# EasyEDA Pro project ProPrj_EasyFOC_2026-04-13.epro, board EasyFOC Ver1.1
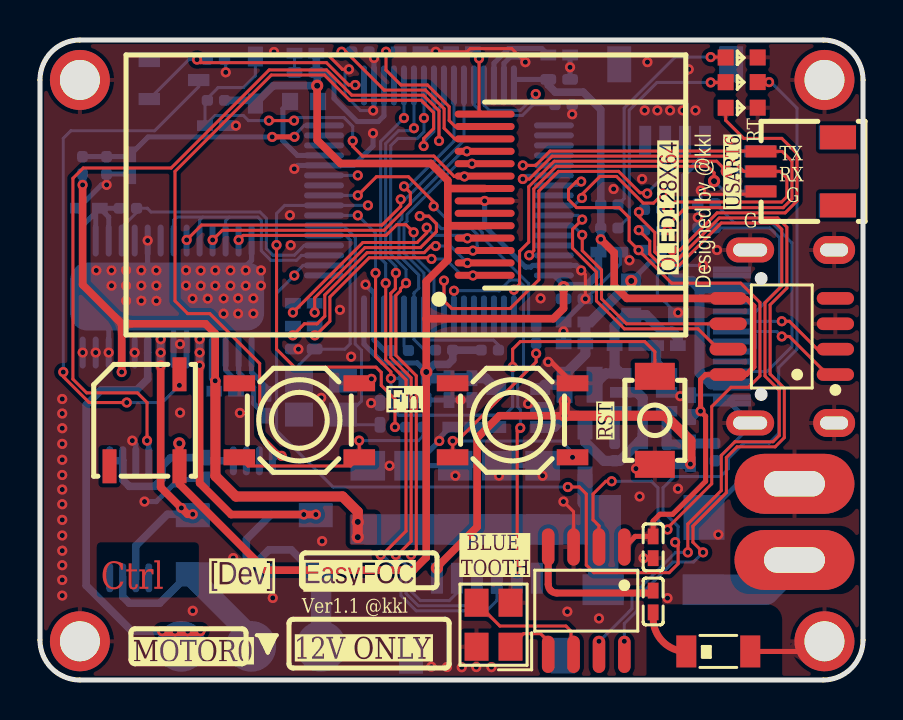
[diagram p4: board, top side]
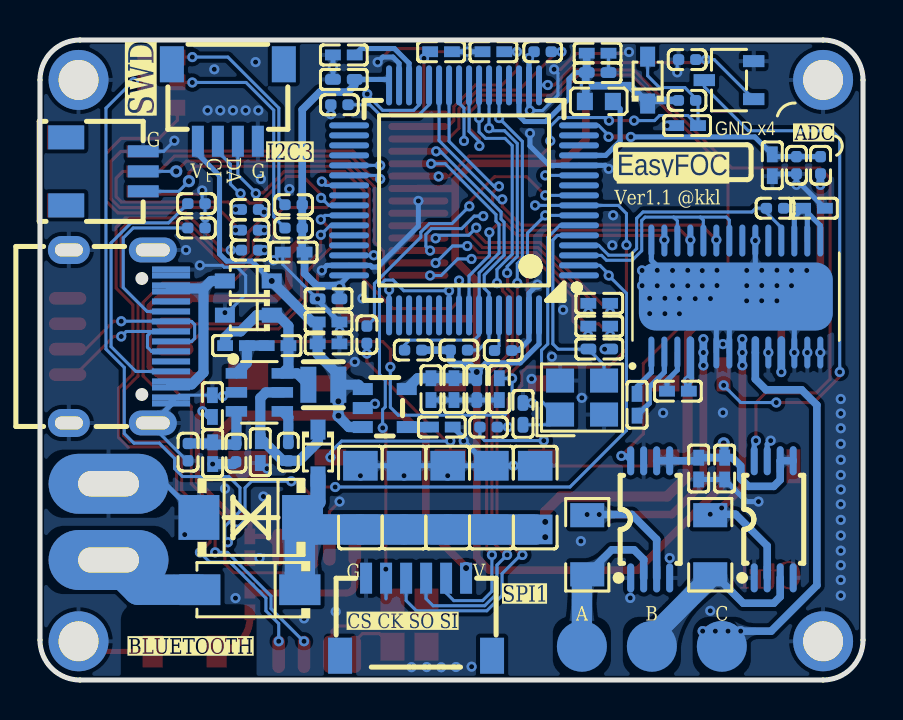
[diagram p5: board, bottom side, seen from below]

Outline 41.17 x 32 mm; copper layers: Top Layer, Bottom Layer. Coordinates in mm from the lower left corner of the outline.
Outline path: 0,30 0,2 arc(0.59,0.59) 2,0 39.17,0 arc(40.58,0.59) 41.17,2 41.17,30 arc(40.58,31.41) 39.17,32 2,32 arc(0.59,31.41) 0,30
Stack: Top Layer 0.035mm / Dielectric1 1.51mm FR4 er 4.5 / Bottom Layer 0.035mm

## Design rules (mm)
template: 自定义配置
spacing copperThickness1oz (default): track to track 0.102, other pairs 0.152 to 0.3
spacing copperThickness2oz: track to track 0.203, other pairs 0.152 to 0.3
track width copperThickness1oz (default): min 0.127, default 0.254, max 2.54
track width copperThickness2oz: min 0.203, default 0.254, max 2.54
differential pair differentialPair (default): width min 0.127, default 0.254, max 2.54; gap min 0.152, default 0.152
via viaSize (default): diameter min 0.508, default 0.508, max 10; hole min 0.254, default 0.254, max 6.299
pour e23671 uses 大师规则

## Placement (name value [footprint] x y rotation side)
BUZZER1  4000Hz  [BUZ-SMD_L5.0-W5.5-P4.60]  5.23 12.98 90 top
C1  100nF  [C0402#2]  19.32 14.54 90 bottom
C2  100nF  [C0402#2]  26.74 19.06 180 bottom
C3  100nF  [C0402#2]  25.97 30.03 180 bottom
C4  100nF  [C0402#2]  13.28 30.37 0 bottom
C5  100nF  [C0402]  13.28 31.34 0 bottom
C6  100nF  [C0402]  18.19 14.54 270 bottom
C7  4.7uF  [C0402]  25.97 31.25 0 bottom
C8  16pF  [C0402#2]  17.01 13.31 270 bottom
C9  16pF  [C0402#2]  13.19 16.55 0 bottom
C10  0.1uF  [C0402]  8.22 10.57 270 bottom
C11  0.1uF  [C0402]  6.92 10.57 270 bottom
C12  10uF  [C0402]  4.54 25.74 270 bottom
C13  10uF  [C0402]  21.61 14.54 90 bottom
C14  100nF  [C0402]  20.46 14.54 90 bottom
C15  10nF  [C0402]  21.07 12.65 0 bottom
C18  100uF  [C1206]  16.4 9.12 270 bottom
C19  100uF  [C1206]  18.59 9.12 270 bottom
C20  100uF  [C1206]  20.78 9.12 270 bottom
C21  100uF  [C1206]  22.96 9.12 270 bottom
C22  100uF  [C1206]  25.14 9.12 270 bottom
C23  100pF  [C0402]  32.53 11.34 270 bottom
C24  100nF  [c0402]  31.37 16.72 0 bottom
C25  100nF  [c0402]  29.29 16.72 180 bottom
C26  100nF  [C0402]  26.74 16.81 0 bottom
C27  10uF  [C0402]  26.74 17.9 0 bottom
C28  10uF  [C0402]  30.15 11.39 270 bottom
C29  10nF  [C0402]  11.3 13.76 270 bottom
C30  0.1u  [C0402]  9.26 14.44 180 bottom
C31  0.47uF  [C0402]  2.45 23.59 0 bottom
C33  1uF  [C0402]  13.2 18.83 0 bottom
C35  4.7uF  [C0402]  28.48 21.39 180 bottom
C36  4.7uF  [C0402]  8.8 27.72 180 bottom
C37  2.2uF  [C0402]  18.49 31.41 180 bottom
C38  4.7uF  [C0402]  21.11 31.41 0 bottom
C39  1uF  [C0402]  13.2 17.69 0 bottom
C42  2.7pF  [C0402]  30.67 3.93 90 top
C43  100nF  [C0402]  30.67 6.63 270 top
C44  100nF  [C0402]  32.54 13.7 270 bottom
CN1  A1002WR-S-3P  [CONN-SMD_A1002WR-S-3P]  37.93 25.43 270 bottom
CN2  A1002WR-S-6P  [CONN-SMD_A1002WR-S-6P]  22.36 3.15 180 bottom
CN6  A1002WR-S-3P  [CONN-SMD_A1002WR-S-3P]  37.99 25.43 90 top
CN7  A1002WR-S-4P  [CONN-SMD_A1002WR-S-4P]  31.77 28.86 0 bottom
D1  SS54  [SMA_L4.4-W2.8-LS5.4-R-RD]  30.67 4.51 0 bottom
D2  SMBJ28CA  [SMB_L4.6-W3.6-LS5.3-BI]  30.63 8.13 180 bottom
D3  B5819WS  [SOD-323_L1.8-W1.3-LS2.5-RD]  30.75 18.24 0 bottom
D4  B5819WS  [SOD-323_L1.8-W1.3-LS2.5-RD]  27.26 11.35 270 bottom
D5  B5819WS  [SOD-323_L1.8-W1.3-LS2.5-RD]  30.75 19.95 0 bottom
D6  B5819WS  [SOD-323_L1.8-W1.3-LS2.5-RD]  10.77 29.99 90 bottom
FB1  600R 100MHz  [L0603]  13.21 28.92 180 bottom
KT6368A1  -  [SOP-8_L4.9-W3.9-P1.27-LS6.0-BL-1]  27.33 3.97 180 top
L1  6.8uH  [IND-SMD_L2.0-W1.6_MHCD201610]  27 14.76 180 bottom
LED1  -  [led_0603]  35.05 31.12 180 top
LED2  -  [led_0603]  35.05 29.89 180 top
LED3  -  [led_0603]  35.05 28.61 180 top
NOREF  -  [Pad_ie98]  37.74 9.81 270 top
NOREF#2  -  [Pad_e98]  39.24 30 0 top
NOREF#3  -  [Pad_e94]  2 30 0 top
NOREF#4  -  [Pad_e96]  2 1.94 0 top
NOREF#5  -  [Pad_e99]  39.24 1.94 0 top
NOREF#6  -  [Pad_ie97]  37.74 6 270 top
P1  电机接插件-3P  [AMASS-MR30-M]  10.56 1.68 180 bottom
Q1  AO3400A  [SOT-23-3_L2.9-W1.6-P1.90-LS2.8-BR]  6.7 29.99 180 bottom
R1  2KΩ  [r0402]  28.48 23.77 0 bottom
R2  5.1KΩ  [r0402]  33.34 22.6 0 bottom
R7  10KΩ  [r0402]  18 16.47 0 bottom
R8  10KΩ  [r0402]  26.19 28.76 0 bottom
R13  5.1KΩ  [r0402]  33.34 23.82 0 bottom
R16  4.7K  [r0402]  8.8 28.98 180 bottom
R17  4.7K  [r0402]  22.5 16.49 0 bottom
R18  10K  [r0402]  4.4 23.59 0 bottom
R19  560K  [r0402]  16.02 31.41 180 bottom
R21  330R  [r0402]  18.73 12.65 180 bottom
R22  330R  [r0402]  24.82 17.26 90 bottom
R23  10K  [r0402]  31.37 11.34 270 bottom
R24  1.8K  [r0402]  33.76 11.39 90 bottom
R25  1M  [r0402]  28.75 11.39 90 bottom
R32  10KΩ  [r0402]  8.8 31.02 180 bottom
R36  100K  [r0402]  2.12 25.74 270 bottom
R37  20K  [r0402]  3.33 25.74 90 bottom
R38  2KΩ  [r0402]  28.48 22.6 0 bottom
R39  4.7K  [r0402]  20.21 16.49 180 bottom
R40  0.01R  [R1206]  13.79 6.76 270 bottom
R41  0.01R  [R1206]  7.64 6.76 90 bottom
R44  100R  [r0402]  30.67 23.53 0 bottom
R45  100R  [r0402]  30.67 22.49 0 bottom
R46  2K  [r0402]  30.66 21.49 0 bottom
SW1  TS-1185-B-A-B-A  [SW-SMD_L4.0-W3.0-LS5.0]  30.76 12.98 270 top
SW3  TS-KG87S  [SW-SMD_4P-L5.2-W5.2-P3.70-LS6.4]  12.97 12.98 180 top
SW4  TS-KG87S  [SW-SMD_4P-L5.2-W5.2-P3.70-LS6.4]  23.64 12.98 180 top
U1  TYPE-C16PIN母座 板上四脚三次molding  [usb-smd_type-c16pin]  37.36 17.18 270 bottom
U2  STM32F401RCT6  [LQFP-64_L10.0-W10.0-P0.50-LS12.0-BL]  19.96 23.98 90 bottom
U4  LP2992IM5X-3.3/NOPB  [SOT-23-5_L2.9-W1.6-P0.95-LS2.8-BR]  23.92 13.6 0 bottom
U5  ME3116AM6G  [SOT-23-6_L2.9-W1.6-P0.95-LS2.8-BL]  30.2 14.38 270 bottom
U8  *  [HTSSOP-28]  6.36 19.17 90 bottom
U9  INA240A2PWR  [TSSOP-8_L4.4-W3.0-P0.65-LS6.4-BL]  10.65 8.03 180 bottom
U10  INA240A2PWR  [TSSOP-8_L4.4-W3.0-P0.65-LS6.4-BL]  4.47 8.04 180 bottom
U12  CH340N  [SOP-8_L4.9-W3.9-P1.27-LS6.0-BL]  37.11 17.18 90 top
U13  SSD1312  [SSD1312-0.96寸]  16.53 24.25 180 top
U14  ANT3216R15753KM1  [ANT-SMD_2P-L3.20-W1.60]  33.93 1.43 0 top
X1  25MHZ 12PF  [CRYSTAL-SMD_4P-L3.2-W2.5-BL]  14.05 14.12 180 bottom
X2  24MHz  [CRYSTAL-SMD_4P-L3.2-W2.5-BL]  22.69 2.77 90 top

## Footprints (pads in the part's own frame, mm; a bottom-side part is the same pattern mirrored in y, then rotated)
AMASS-MR30-M
  rrect 2.5x2.54 smd: 1(-3.5,0) 2(0,0) 3(3.5,0)
ANT-SMD_2P-L3.20-W1.60
  rect 1x1.6 smd: 1(-1.6,0) 2(1.6,0)
BUZ-SMD_L5.0-W5.5-P4.60
  rect 1.7x0.7 smd: 1(-2.3,-1.75) 2(2.3,-1.75) 3(-2.3,1.75)
C0402
  rect 0.79x0.54 smd: 1(-0.545,0) 2(0.545,0)
C0402#2
  rrect 0.79x0.54 smd: 1(-0.545,0) 2(0.545,0)
c0402
  rect 0.79x0.54 smd: 1(-0.545,0) 2(0.545,0)
C1206
  rect 1.485x1.728 smd: 1(-1.593,0) 2(1.593,0)
CONN-SMD_A1002WR-S-3P
  rect 0.6x1.55 smd: 1(-1.003,1.926) 2(-0.001,1.925) 3(0.997,1.926)
  rect 1.2x1.8 smd: 4(1.701,-1.926) 5(-1.701,-1.926)
CONN-SMD_A1002WR-S-4P
  rect 0.6x1.55 smd: 1(-1.5,1.925) 2(-0.5,1.925) 3(0.5,1.925) 4(1.5,1.925)
  rect 1.2x1.8 smd: 5(2.8,-1.925) 6(-2.8,-1.925)
CONN-SMD_A1002WR-S-6P
  rect 0.6x1.55 smd: 1(-2.501,1.938) 2(-1.5,1.938) 3(-0.497,1.936) 4(0.501,1.937) 5(1.502,1.937) 6(2.502,1.937)
  rect 1.2x1.8 smd: 7(3.801,-1.938) 8(-3.801,-1.937)
CRYSTAL-SMD_4P-L3.2-W2.5-BL
  rect 1.4x1.2 smd: 1(-1.1,-0.85) 2(1.1,-0.85) 3(1.1,0.85) 4(-1.1,0.85)
HTSSOP-28
  rrect 1.6x0.3 smd: 1(-2.8,4.225) 2(-2.8,3.575) 3(-2.8,2.925) 4(-2.8,2.275) 5(-2.8,1.625) 6(-2.8,0.975) 7(-2.8,0.325) 8(-2.8,-0.325) 9(-2.8,-0.975) 10(-2.8,-1.625) 11(-2.8,-2.275) 12(-2.8,-2.925) 13(-2.8,-3.575) 14(-2.8,-4.225) 15(2.8,-4.225) 16(2.8,-3.575) 17(2.8,-2.925) 18(2.8,-2.275) 19(2.8,-1.625) 20(2.8,-0.975) 21(2.8,-0.325) 22(2.8,0.325) 23(2.8,0.975) 24(2.8,1.625) 25(2.8,2.275) 26(2.8,2.925) 27(2.8,3.575) 28(2.8,4.225)
  rrect 3.4x9.7 smd: 29(0,0)
IND-SMD_L2.0-W1.6_MHCD201610
  rect 0.8x1.8 smd: 1(-0.75,0) 2(0.75,0)
L0603
  rect 0.8x0.864 smd: 1(-0.7,0) 2(0.7,0)
led_0603
  rect 0.8x0.8 smd: 1(-0.851,-0.01) 2(0.75,-0.005)
LQFP-64_L10.0-W10.0-P0.50-LS12.0-BL
  oval 0.3x2 smd: 1(-3.75,-5.75) 2(-3.25,-5.75) 3(-2.75,-5.75) 4(-2.25,-5.75) 5(-1.75,-5.75) 6(-1.25,-5.75) 7(-0.75,-5.75) 8(-0.25,-5.75) 9(0.25,-5.75) 10(0.75,-5.75) 11(1.25,-5.75) 12(1.75,-5.75) 13(2.25,-5.75) 14(2.75,-5.75) 15(3.25,-5.75) 16(3.75,-5.75) 33(3.75,5.75) 34(3.25,5.75) 35(2.75,5.75) 36(2.25,5.75) 37(1.75,5.75) 38(1.25,5.75) 39(0.75,5.75) 40(0.25,5.75) 41(-0.25,5.75) 42(-0.75,5.75) 43(-1.25,5.75) 44(-1.75,5.75) 45(-2.25,5.75) 46(-2.75,5.75) 47(-3.25,5.75) 48(-3.75,5.75)
  oval 2x0.3 smd: 17(5.75,-3.75) 18(5.75,-3.25) 19(5.75,-2.75) 20(5.75,-2.25) 21(5.75,-1.75) 22(5.75,-1.25) 23(5.75,-0.75) 24(5.75,-0.25) 25(5.75,0.25) 26(5.75,0.75) 27(5.75,1.25) 28(5.75,1.75) 29(5.75,2.25) 30(5.75,2.75) 31(5.75,3.25) 32(5.75,3.75) 49(-5.75,3.75) 50(-5.75,3.25) 51(-5.75,2.75) 52(-5.75,2.25) 53(-5.75,1.75) 54(-5.75,1.25) 55(-5.75,0.75) 56(-5.75,0.25) 57(-5.75,-0.25) 58(-5.75,-0.75) 59(-5.75,-1.25) 60(-5.75,-1.75) 61(-5.75,-2.25) 62(-5.75,-2.75) 63(-5.75,-3.25) 64(-5.75,-3.75)
Pad_e94
  round 3 hole 2: 65(0,0)
Pad_e96
  round 3 hole 2: 65(0,0)
Pad_e98
  round 3 hole 2: 65(0,0)
Pad_e99
  round 3 hole 2: 65(0,0)
Pad_ie97
  rrect 3x6 hole 1.27x3.048: (0,0)
Pad_ie98
  rrect 3x6 hole 1.27x3.048: (0,0)
r0402
  rrect 0.567x0.541 smd: 1(-0.432,0) 2(0.432,0)
R1206
  rect 1.208x1.701 smd: 1(-1.479,0) 2(1.479,0)
SMA_L4.4-W2.8-LS5.4-R-RD
  rect 2.062x1.539 smd: 1(2.503,0) 2(-2.503,0)
SMB_L4.6-W3.6-LS5.3-BI
  rect 2.047x2.241 smd: 1(-2.591,0) 2(2.591,0)
SOD-323_L1.8-W1.3-LS2.5-RD
  rect 1x0.75 smd: 1(-1.173,0) 2(1.173,0)
SOP-8_L4.9-W3.9-P1.27-LS6.0-BL
  oval 0.63x1.865 smd: 1(-1.905,-2.683) 2(-0.635,-2.683) 3(0.635,-2.683) 4(1.905,-2.683) 5(1.905,2.683) 6(0.635,2.683) 7(-0.635,2.683) 8(-1.905,2.683)
SOP-8_L4.9-W3.9-P1.27-LS6.0-BL-1
  oval 0.63x1.865 smd: 1(-1.905,-2.683) 2(-0.635,-2.683) 3(0.635,-2.683) 4(1.905,-2.683) 5(1.905,2.683) 6(0.635,2.683) 7(-0.635,2.683) 8(-1.905,2.683)
SOT-23-3_L2.9-W1.6-P1.90-LS2.8-BR
  rect 1.07x0.6 smd: 1(1.235,-0.95) 2(1.235,0.95) 3(-1.235,0)
SOT-23-5_L2.9-W1.6-P0.95-LS2.8-BR
  rect 1x0.6 smd: 1(1.1,-0.95) 2(1.1,0) 3(1.1,0.95) 4(-1.1,0.95) 5(-1.1,-0.95)
SOT-23-6_L2.9-W1.6-P0.95-LS2.8-BL
  rect 0.532x1.072 smd: 1(-0.95,-1.149) 2(0,-1.149) 3(0.95,-1.149) 4(0.95,1.149) 5(0,1.149) 6(-0.95,1.149)
SSD1312-0.96寸
  oval 3x0.35 smd: 1(-5.715,4.011) 2(-5.715,3.392) 3(-5.715,2.772) 4(-5.715,2.151) 5(-5.715,1.531) 6(-5.715,0.911) 7(-5.715,0.291) 8(-5.715,-0.329) 9(-5.715,-0.949) 10(-5.715,-1.569) 11(-5.715,-2.189) 12(-5.715,-2.809) 13(-5.715,-3.429) 14(-5.715,-4.049)
SW-SMD_4P-L5.2-W5.2-P3.70-LS6.4
  rect 1.58x0.8 smd: 1(-3,1.85) 2(3,1.85) 3(-3,-1.85) 4(3,-1.85)
SW-SMD_L4.0-W3.0-LS5.0
  rect 1.35x2 smd: 1(-2.2,0) 2(2.2,0)
TSSOP-8_L4.4-W3.0-P0.65-LS6.4-BL
  oval 0.353x1.454 smd: 1(-0.975,-2.927) 2(-0.325,-2.927) 3(0.325,-2.927) 4(0.975,-2.927) 5(0.975,2.927) 6(0.325,2.927) 7(-0.325,2.927) 8(-0.975,2.927)
usb-smd_type-c16pin
  oval 1.25x2.4 hole 0.65x1.7: 17(-4.325,1.835) 18(4.325,1.835)
  oval 1.4x2.1 hole 0.65x1.4: 19(-4.325,-2.365) 20(4.325,-2.365)
  rect 0.3x1.905 smd: A1(-3.35,2.746) A4(-2.55,2.746) A5(-1.25,2.746) A6(-0.25,2.746) A7(0.25,2.746) A8(1.25,2.746) A9(2.55,2.746) A12(3.35,2.746) B1(3.05,2.746) B4(2.25,2.746) B5(1.75,2.746) B6(0.75,2.746) B7(-0.75,2.746) B8(-1.75,2.746) B9(-2.25,2.746) B12(-3.05,2.746)

## Nets
As in the schematic, except:
GND: C1.1 C2.1 C3.1 C4.1 C5.1 C6.2 C7.2 C8.1 C9.1 C10.2 C11.2 C12.2 C13.1 C14.1 C15.1 C18.1 C19.1 C20.1 C21.1 C22.1 C26.1 C27.1 C28.2 C31.1 C35.1 C36.1 C37.1 C38.1 C43.2 C44.1 CN1.1 CN2.1 CN6.1 CN7.1 D2.1 D3.2 KT6368A1.3 LED1.1 LED3.1 NOREF. NOREF#2.65 NOREF#3.65 NOREF#4.65 NOREF#5.65 Q1.2 R2.1 R7.1 R8.2 R13.1 R19.1 R24.1 R32.1 R37.1 SW1.2 SW3.3 SW3.4 SW4.3 SW4.4 U1.17 U1.18 U1.19 U1.20 U1.A1 U1.A12 U1.B1 U1.B12 U2.12 U2.18 U2.31 U2.47 U2.63 U4.2 U5.2 U8.6 U8.7 U8.10 U8.12 U8.13 U8.14 U8.20 U8.28 U8.29 U9.1 U9.4 U9.7 U10.1 U10.4 U10.7 U12.3 U13.7 U14.2 X1.2 X1.4 X2.2 X2.4
VCC_IN: D1.1 NOREF#6.

Pads without a net: BUZZER1 3; CN1 4 5; CN2 7 8; CN6 4 5; CN7 5 6; U1 A8 B8; U8 19 21; U12 4; U13 6

## Via types
v1: diameter 0.508, hole 0.254, Top Layer to Bottom Layer, 242 vias
v2: diameter 0.61, hole 0.305, Top Layer to Bottom Layer, 12 vias

## Routing (per net, layer and track width the routed paths; a pad name or vN(x,y) marks a point on that pad's centre or on a via; arc(x,y) is an arc through that point)
3.3V: length 138.8
  Top Layer w0.254: U12.5 35.33,19.08 35.71,18.7 35.71,15.65 35.33,15.27 U12.8 33.3,15.27 33.04,15.02 v1(33.04,13.44) 33.3,13.19 33.3,9.94 31.64,8.29 31.01,8.29 30.67,7.95 C43.1 29.78,7.18 29.25,6.65 KT6368A1.1
  Top Layer w0.381: 20.4,24.57 U13.8 ; 20.4,24.57 20.4,22.71 ; 20.4,24.57 20.4,24.98 19.55,25.83 15.03,25.83 13.86,27 v2(13.86,29.72) ; 20.4,22.71 U13.5 ; 20.4,22.71 20.4,21.01 19.32,19.93 19.32,18.06 ; v2(26.19,19.64) 26.19,18.58 25.68,18.06 19.32,18.06 ; U12.5 29.36,19.08 28.72,19.72 28.72,21.36 v1(28.05,22.04) ; 19.32,18.06 v2(19.32,15.4) 19.32,15.4 19.32,6.13 18.68,5.49 11.28,5.49 6.98,9.79 BUZZER1.1 6.98,11.82 v2(6.97,11.83)
  Bottom Layer w0.254: C4.2 14.39,30.37 14.71,30.05 14.71,29.08 15.87,27.92 16.92,27.92 17.21,28.21 U2.19 ; C3.2 23.71,30.03 U2.32 ; v1(33.04,13.44) 32.75,13.15 C44.2 ; U2.64 16.21,16.79 17.15,15.86 18.87,15.86 v2(19.32,15.4) C1.2 ; U2.48 26.19,19.75 v2(26.19,19.64)
  Bottom Layer w0.381: U10.5 U10.6 4.14,10.01 4.47,9.68 5.74,9.68 6.12,10.06 6.12,10.7 6.54,11.12 C11.1 ; v2(13.86,29.72) 13.86,28.97 FB1.1 ; v2(13.86,29.72) 13.86,30.33 C4.2 C5.2 ; v2(13.86,29.72) 11.67,29.72 D6.1 10.62,28.98 9.24,28.98 ; C11.1 C10.1 8.38,10.96 U9.5 10.32,10.96 ; C11.1 6.92,11.79 v2(6.97,11.83) ; C3.2 25.43,29.75 25.77,29.4 27.17,29.4 28.05,28.52 R1.1 R38.1 v1(28.05,22.04) 28.05,21.51 C35.2 27.94,20.32 27.33,19.72 26.27,19.72 v2(26.19,19.64) C2.2 ; 22.07,16.49 R39.1 20.65,16.01 20.42,15.78 19.71,15.78 19.32,15.39
  Bottom Layer w0.508: C1.2 C14.2 C13.2 22.28,15.09 U4.5
5V: length 42.4
  Top Layer w0.381: v2(26.24,13.21) 22.98,13.21 21.87,12.1 21.87,7.65 19.86,5.64 v2(19.86,5.6)
  Top Layer w0.508: v1(32.53,10.8) 32.53,11.97 31.29,13.21 v2(26.24,13.21) 26.24,13.22 v2(26.24,13.93)
  Bottom Layer w0.254: CN7.4 33.27,26.3 32.19,25.21 32.19,21.3 31.83,20.94 30.57,20.94 v2(29.58,19.95)
  Bottom Layer w0.508: v2(29.58,19.95) 29.58,19.93 27.54,17.9 C27.2 C26.2 27.28,16.3 26.24,15.26 L1.2 ; L1.2 25.24,14.76 U4.1 ; L1.2 v2(26.24,13.93) 26.24,13.17 25.72,12.65 U4.3 ; 31.37,10.91 31.48,10.8 v1(32.53,10.8)
GND: length 122.7
  Top Layer w0.152: v1(27.28,19.06) 27.28,20.27 v1(27.07,20.48) ; v1(24.28,30.89) 23.6,31.57 21.51,31.57 21.36,31.41 v1(19.8,31.41) ; v1(33.06,24.48) 33.25,24.29 35.93,24.29 CN6.1 ; KT6368A1.3 26.69,8.41 v1(26.18,8.92) ; v1(11.71,31.4) 11.78,31.33 14.33,31.33 15.12,30.53 v1(15.45,30.53)
  Top Layer w0.254: U14.2 38.73,1.43 NOREF#5.65 ; v1(25.42,15.91) 25.57,15.91 SW4.3
  Bottom Layer w0.152: v1(16.67,28.47) 16.03,28.47 15.26,29.24 15.26,30.34 v1(15.45,30.53) ; 33.76,10.96 33.81,10.96 35.52,12.67 U1.18 ; v1(27.28,19.06) 27.3,19.06 29.03,20.78 29.03,21.39 29.08,21.39 v1(29.49,20.99) ; v1(34.45,26.97) 34.98,26.43 CN1.1 ; 16.46,31.33 16.46,31.35 ; U5.2 31.84,14.38 v1(32.03,14.19) 32.49,14.19 C44.1 34.2,14.24 U1.A12 ; v1(33.17,20.73) 32.05,20.73 31.96,20.64 31.3,20.64 30.88,20.22 30.88,19.28 D3.2 ; v1(9.29,30.38) 9.29,30.96 R32.1 ; v1(33.06,24.48) 33.06,23.97 R13.1 32.91,23.13 v1(32.9,23.13) 32.91,23.12 R2.1 ; 12.73,30.37 12.73,31.34
  Bottom Layer w0.254: U1.B1 U1.A12 34.61,13.76 U1.18 ; v1(3.44,16.37) 3.44,17.99 4.61,19.17 U8.29 ; 19.03,31.41 v1(19.8,31.41) C38.1 ; U2.31 23.21,30.84 23.52,31.15 24.02,31.15 v1(24.28,30.89) ; 26.62,28.29 R8.2 ; 25.14,10.71 18.74,10.71 ; v1(16.57,13.85) 17,13.85 C8.1 ; U8.7 6.69,18.85 ; 6.69,18.85 U8.29 ; 6.69,18.85 7.34,18.2 U8.6 ; R7.1 17.23,16.47 16.71,17 U2.63 16.71,19.35 v1(16.28,19.77) ; U8.29 8.77,19.17 10.59,20.99 U8.28 ; U8.29 5.39,20.15 v1(5.39,21.97) ; 18.74,10.71 v1(17.48,10.71) 16.4,10.71 ; 18.74,10.71 v1(19.97,11.95) 19.97,12.1 C15.1 ; v1(12.72,25.56) 12.89,25.73 U2.12 15.69,25.73 16.66,26.7 v1(16.66,27.34) ; C26.1 26.18,16.81 v1(26.18,17.43) 26.19,17.44 C27.1 27.28,18.99 v1(27.28,19.06) ; 18.2,14 C1.1 C14.1 21.03,14 v1(21.04,14) 21.04,14 C13.1 ; 3.33,25.3 4.43,25.3 C12.2 ; 3.33,25.3 v1(3.33,24.76) 3.08,24.76 C31.1 ; 3.33,25.3 R37.1 ; v1(5.23,8.92) 5.82,8.92 C11.2 C10.2 ; R19.1 16.46,31.35 v1(16.71,31.1) U2.18 16.71,28.52 v1(16.67,28.47) ; D2.1 34.9,9.81 37.74,9.81 ; v1(4.62,11.97) 4.79,11.8 U10.7 ; C3.1 v1(26.52,30.64) 26.52,31.25 ; v1(22.24,23.95) 22.24,22.7 24.29,20.65 24.56,20.65 24.64,20.73 U2.47 26.82,20.73 v1(27.07,20.48)
  vias: v1(1.11,14.05) v1(1.11,13.32) v1(1.11,12.59) v1(1.11,11.81) v1(1.11,11.01) v1(1.11,10.25) v1(1.11,9.52) v1(1.11,8.79) v1(1.11,8.01) v1(1.11,7.23) v1(1.11,6.47) v1(1.11,5.74) v1(1.11,5) v1(1.11,4.22) v1(2.14,16.37) v1(2.82,20.48) v1(2.79,16.37) v1(3.58,20.48) v1(3.58,19.72) v1(4.31,20.49) v1(4.31,19.72) v1(4.31,18.96) v1(4.74,16.37) v1(5.07,20.48) v1(5.07,19.72) v1(5.07,18.96) v1(5.82,20.48) v1(5.82,19.72) v1(5.82,18.96) v1(7.01,16.8) v1(7.01,13.37) v1(7.31,20.49) v1(7.31,19.72) v1(7.63,19.07) v1(7.64,3.46) v1(8.04,20.47) v1(8.04,19.71) v1(8.39,19.07) v1(8.77,20.48) v1(8.77,19.71) v1(9.18,19.08) v1(9.18,18.31) v1(9.53,20.48) v1(9.53,19.72) v1(9.67,6.1) v1(9.8,27.72) v1(9.91,19.09) v1(9.91,18.32) v1(10,13.35) v1(10.29,20.48) v1(10.29,19.71) v1(10.67,19.08) v1(10.67,18.32) v1(11.05,20.48) v1(11.05,19.72) v1(11.64,4.1) v1(12.5,23.24) v1(12.54,21.74) v1(12.93,16.54) v1(14.07,14.11) v1(14.11,6.94) v1(15,18.51) v1(15.56,16.17) v1(16.58,15.06) v1(19.58,0.67) v1(20.36,0.65) v1(20.78,10.21) v1(21.1,0.64) v1(21.82,0.65) v1(22.58,0.64) v1(22.96,10.21) v1(24.42,13.81) v1(25.04,19.08) v1(25.14,10.21) v1(26.38,3.42) v1(26.62,28.29) v1(27.96,3.08) v1(28.69,24.55) v1(29.81,10.57) v1(29.99,9.17) v1(30.12,25.05) v1(30.19,6.09) v1(30.25,28.48) v1(30.39,30.89) v1(30.88,28.48) v1(31.39,4.09) v1(31.52,28.48) v1(31.92,18.37) v1(31.91,9.57) v1(32.15,28.48) v1(32.45,30.53) v1(32.79,28.48) v1(33.86,21.5) v1(33.93,7.27)
V3P3: length 6.1
  Bottom Layer w0.254: C31.2 3.97,23.59 ; C31.2 2.79,23.38 ; C31.2 3.44,23.15 U8.17 ; 2.79,23.38 U8.16 ; 2.79,23.38 2.14,22.73 U8.15
VBUS: length 8.9
  Bottom Layer w0.508: 34.62,19.57 32.99,19.57 ; 32.99,19.57 32.61,19.95 D5.2 ; 32.99,19.57 32.99,15.37 33.58,14.78 34.61,14.78
VCC: length 54
  Top Layer w0.381: 4.09,17.81 2.13,19.76 v1(2.13,24.75) ; 4.09,17.81 8.28,17.81 8.76,17.32 v1(8.76,14.96) ; 4.09,17.81 v1(4.09,15.4)
  Top Layer w0.508: v1(8.76,14.96) 8.77,14.95 8.77,10.2 9.8,9.17 15.14,9.17 15.9,8.41 v2(15.9,7.91) v2(15.9,7.14)
  Bottom Layer w0.381: v1(2.13,24.75) 2.13,25.3 R36.2 ; v1(4.09,15.4) 4.09,17 ; 8.64,16.98 8.64,15.09 v1(8.76,14.96) 8.76,14.49 C30.2
  Bottom Layer w0.762: D4.2 27.26,8.9 D2.2
  Bottom Layer w1.524: 16.4,7.52 18.58,7.52 C19.2 C20.2 C21.2 C22.2 27.44,7.53 D2.2 28.17,7.99 D1.2
VCC_IN: length 5.2
  Bottom Layer w1.524: 37.74,6 36.26,4.51 D1.1
ADC1: length 12.8
  Top Layer w0.254: v1(12.73,27.16) 11.62,27.16 v1(11.62,27.15)
  Bottom Layer w0.152: U2.16 13.23,27.73 12.73,27.23 v1(12.73,27.16)
  Bottom Layer w0.254: v1(11.62,27.15) 5.41,27.15 C12.1 4.43,26.17 R37.2 R36.1
BEEPER: length 12.6
  Top Layer w0.152: v1(15.77,29.75) 15.45,29.75 14.33,30.87 8.01,30.87 v1(7.86,31.02)
  Bottom Layer w0.152: v1(15.77,29.75) 16.19,29.75 U2.17 ; Q1.1 7.45,31.02 v1(7.86,31.02) R32.2
BOOT0: length 1.8
  Bottom Layer w0.152: R7.2 18.21,16.7 U2.60
BT_RX: length 24.3
  Top Layer w0.152: CN6.3 37.12,26.43 37.61,25.94 37.61,24.06 37.17,23.62 32.29,23.62 31.38,22.71 v1(31.38,22.49) ; 36,26.45 25.51,26.45 24.8,25.73 v1(24.15,25.73)
  Bottom Layer w0.152: v1(24.15,25.73) U2.37
BT_STA: length 37.6
  Top Layer w0.152: v1(28.6,9.94) 28.31,9.94 27.67,9.3 27.67,8.01 27.96,7.71 27.96,6.65 ; v1(27.07,24.92) 26.83,24.92 26.44,24.53 26.44,24.03 26.84,23.62 28.97,23.62 29.47,23.12 29.47,21.97 v1(29.94,21.49) 31.59,19.84 35.05,19.84 36.01,18.88 36.01,15.21 35.44,14.64 34.57,14.64 33.6,13.67 33.6,9.81 31.39,7.6 v1(31.39,7.52)
  Bottom Layer w0.152: v1(27.07,24.92) 26.88,24.73 U2.39 ; v1(28.6,9.94) 30.58,9.94 30.91,9.61 30.91,8 v1(31.39,7.52)
BT_TX: length 22.9
  Top Layer w0.152: v1(31.38,23.53) 31.76,23.9 37.1,23.9 37.36,24.16 37.36,25.09 37.02,25.43 CN6.2 35.2,25.43 34.44,26.19 25.62,26.19 24.48,25.05 v1(24.15,25.05)
  Bottom Layer w0.152: v1(24.15,25.05) 24.33,25.23 U2.38
D+: length 8.2
  Top Layer w0.152: v1(37.11,17.18) 37.49,17.18 39.39,15.27 U12.1
  Bottom Layer w0.152: 35.59,17.43 35.8,17.22 35.8,16.64 35.58,16.43 U1.B6 ; 35.59,17.43 36.86,17.43 v1(37.11,17.18) ; 35.59,17.43 U1.A6
D-: length 8.9
  Top Layer w0.152: v1(37.11,17.94) 37.49,17.94 38.88,16.54 U12.2
  Bottom Layer w0.152: U1.A7 33.58,16.93 33.43,17.08 33.43,17.77 33.58,17.93 U1.B7 34.63,17.94 v1(37.11,17.94)
DRV_EN: length 13
  Bottom Layer w0.152: 8.14,23.14 7.99,22.99 U8.24 ; 8.14,23.14 9.47,23.14 ; 8.14,23.14 6.84,23.14 6.69,22.99 U8.22 ; 9.47,23.14 10.9,23.14 11.07,22.98 11.07,21.46 11.55,20.99 12.83,20.99 13.08,21.23 U2.3 ; 9.47,23.14 9.29,22.96 U8.26
DRV_FAULT: length 13.4
  Bottom Layer w0.152: U2.4 13.22,21.73 12.73,21.24 11.65,21.24 11.33,21.57 11.33,23.08 11.01,23.4 5.56,23.4 5.37,23.59 R18.2 4.83,23.37 4.09,22.62 U8.18
I2C3_SCL: length 10
  Top Layer w0.152: 31.14,24.29 30.69,23.84 30.17,23.84 28.84,25.18 28.01,25.18 27.11,24.28 v1(27.11,24.1)
  Bottom Layer w0.152: U2.41 26.72,23.73 26.94,23.94 26.96,23.94 27.12,24.1 ; 31.14,24.29 31.64,24.8 31.64,25.79 32.27,26.42 CN7.3
  vias: v1(31.14,24.33)
I2C3_SDA: length 21.9
  Top Layer w0.152: v1(20.21,19.97) 20.21,18.96 20.6,18.57 23.52,18.57 24.96,20.01 24.96,24.45 25.93,25.43 28.95,25.43 30.02,24.36 30.34,24.36 v1(30.37,24.33)
  Bottom Layer w0.152: v1(20.21,19.97) U2.56 ; 30.37,24.36 31.27,25.26 CN7.2
KEY0: length 20.8
  Top Layer w0.152: v1(11.83,21.75) 11.83,16.54 12.73,15.64 16.81,15.64 17.07,15.38 17.07,14.73 17.76,14.05 v1(17.76,12.65)
  Bottom Layer w0.152: v1(16.4,23.73) U2.8 12.24,23.73 11.83,23.32 v1(11.83,21.75) ; R21.2 18.3,12.65 v1(17.76,12.65)
KEY1: length 15.4
  Top Layer w0.152: v1(19.69,23.69) 19.69,23.9 18.43,25.16 16.83,25.16 v1(15.9,24.23)
  Bottom Layer w0.152: v1(19.69,23.69) 20.56,22.82 21.69,22.82 22.12,22.39 22.12,22.14 24.44,19.82 24.44,18.07 R22.2 ; U2.9 v1(15.9,24.23)
MOTOR_A: length 8.2
  Bottom Layer w0.381: U9.2 10.97,6.03 11.45,6.51 12.57,6.51 R40.2
  Bottom Layer w1.016: P1.1 14.06,5.01 R40.2
MOTOR_A_CS: length 19
  Top Layer w0.381: v1(13.8,8.27) v1(13.2,8.27) 9.56,8.27 7.99,9.85 v1(7.99,15.73)
  Bottom Layer w0.381: R40.1 13.8,8.25 v1(13.8,8.27) ; U8.5 7.99,15.73 ; 10.32,5.11 10.32,7.03 11.57,8.27 v1(13.2,8.27) ; v1(7.99,17.04) 7.99,16.37
  vias: v1(7.99,16.37)
MOTOR_B: length 10.1
  Bottom Layer w0.381: 7.43,5.28 5.99,3.84 4.47,3.84 4.14,4.17 U10.3 ; 7.47,5.28 R41.1
  Bottom Layer w1.016: P1.2 10.56,2.19 7.47,5.28 7.43,5.28
MOTOR_B_CS: length 14.7
  Top Layer w0.381: v1(6.04,15.73) 6.04,9.64 v1(7.07,8.6) 7.39,8.29 v1(7.64,8.29)
  Bottom Layer w0.381: v1(6.04,17.04) 6.04,16.38 v1(6.04,16.37) 6.04,15.73 ; U10.2 4.79,6.71 6.37,8.29 v1(7.64,8.29) R41.2
MOTOR_C: length 21.2
  Top Layer w0.508: 8.02,2.44 v1(7.39,2.44) v1(6.75,2.44) v1(6.12,2.44)
  Bottom Layer w0.381: v1(6.12,2.44) 4.6,2.44 2.31,4.73 2.31,13.75 3.07,14.51 4.85,14.51 5.39,15.05 U8.9 5.39,17
  vias: v1(8.02,2.44)
NRST: length 30.7
  Top Layer w0.152: v1(23.64,15.65) 23.64,16.54 24.02,16.92 30.25,16.92 30.76,16.41 SW1.1 ; v1(17.55,15.08) 17.55,15.4 16.79,16.17 v1(16.79,20.35) ; v1(15.9,23.23) 15.9,23.14
  Bottom Layer w0.152: C6.1 18.18,15.08 v1(17.55,15.08) 17.55,13.61 17.93,13.24 23.24,13.24 23.64,13.64 v1(23.64,15.65) ; U2.7 v1(15.9,23.23) 16.79,22.34 v1(16.79,20.35)
OLED_SCL: length 15
  Bottom Layer w0.152: 22.93,16.49 22.93,16.74 22.68,16.99 19.45,16.99 19.21,17.24 U2.58 19.2,18.24 19.2,20.35 18.21,21.35 18.21,22.79 18.36,22.94 18.36,23.27 20.9,25.81 v1(21.61,25.81)
OLED_SDA: length 12.7
  Bottom Layer w0.152: R39.2 19.24,16.49 18.71,17.03 U2.59 18.71,19.35 18.95,19.59 18.95,20.25 17.95,21.24 17.95,22.89 18.11,23.04 18.11,23.4 21.14,26.43 v1(21.35,26.43)
OSC_IN: length 10.4
  Bottom Layer w0.152: U2.5 15.28,22.23 15.52,22 15.52,16.81 15.25,16.54 13.75,16.54 ; 13.75,16.54 C9.2 ; 13.75,16.54 12.95,15.75 X1.3
OSC_OUT: length 13.4
  Bottom Layer w0.152: U2.6 15.17,22.73 15.77,22.13 15.77,16.8 16.08,16.49 16.08,13.95 15.41,13.27 15.15,13.27 15.66,12.76 C8.2
PA5: length 34
  Top Layer w0.152: v1(17.04,6.25) 17.12,6.25 18.31,7.44 18.31,15.01 17.29,16.02 v1(17.29,19.84)
  Bottom Layer w0.152: v1(17.29,19.84) 17.29,20.82 17.04,21.08 17.04,26.93 v1(18.21,28.1) U2.21 ; v1(17.04,6.25) 17.12,6.25 18.06,5.32 18.06,4.22 18.82,3.46 22.34,3.46 22.85,3.97 CN2.3
PA6: length 32.6
  Top Layer w0.152: v1(17.8,6.25) 17.88,6.25 18.56,6.94 18.56,15.11 17.55,16.13 17.55,19.33 17.78,19.56 17.78,20.33 v1(17.8,20.35)
  Bottom Layer w0.152: v1(17.8,6.25) 18.31,5.75 18.31,4.33 18.92,3.71 21.51,3.71 21.86,4.06 CN2.4 ; v1(17.8,20.35) 17.8,20.67 17.29,21.18 17.29,26.83 17.93,27.46 18.58,27.46 v1(18.71,27.59) U2.22
PA7: length 31
  Top Layer w0.152: v1(18.31,19.84) 18.03,19.56 18.03,19.46 17.8,19.23 17.8,16.23 18.82,15.21 18.82,6.51 v1(18.56,6.25)
  Bottom Layer w0.152: v1(18.56,6.25) 18.56,4.43 19.03,3.97 20.47,3.97 20.86,4.35 CN2.5 ; U2.23 v1(19.21,28.1) 19.21,27.41 18.88,27.08 17.91,27.08 17.55,26.72 17.55,21.29 18.31,20.53 v1(18.31,19.84)
PA9: length 13.9
  Top Layer w0.152: U12.7 33.93,16.54 32.92,17.56 29.23,17.56 27.83,18.95 27.83,20.4 26.64,21.59 26.64,22.54 v1(27.12,23.02)
  Bottom Layer w0.152: U2.42 26.92,23.23 v1(27.12,23.02)
PA10: length 12.1
  Top Layer w0.152: v1(27.12,22.26) 27.13,22.25 27.13,21.47 28.09,20.5 28.09,19.06 29.34,17.81 U12.6
  Bottom Layer w0.152: v1(27.12,22.26) 26.65,22.73 U2.43
PA13: length 17.2
  Top Layer w0.152: v1(24.47,21.24) 24.7,21.46 24.7,24.56 25.83,25.69 33.39,25.69 33.72,25.36 v2(33.72,24.94)
  Bottom Layer w0.152: v2(33.72,24.94) 34.23,24.43 36,24.43 ; U2.46 25.7,21.24 v1(24.47,21.24)
PA14: length 19
  Top Layer w0.152: v2(34.36,25.43) 33.85,25.94 25.72,25.94 24.45,24.66 24.45,21.89 23.99,21.44 23.99,19.8 v1(23.7,19.51)
  Bottom Layer w0.152: v1(23.7,19.51) 23.71,19.51 U2.49 ; v2(34.36,25.43) CN1.2
PB0: length 17.9
  Top Layer w0.152: v1(8.64,22) 9.12,22.48 17.21,22.48 18.53,23.8 18.53,24.36 v1(18.21,24.68)
  Bottom Layer w0.152: v1(8.64,22) U8.25 ; U2.26 20.71,26.94 18.45,24.68 v1(18.21,24.68)
PB1: length 18.9
  Top Layer w0.152: v1(18.04,24.03) 18.04,23.68 17.11,22.75 8.08,22.75 v1(7.34,22)
  Bottom Layer w0.152: U2.27 21.21,26.97 18.27,24.03 v1(18.04,24.03) ; v1(7.34,22) U8.23
PB2: length 5.5
  Bottom Layer w0.152: R8.1 24.67,28.76 24.13,28.23 22.24,28.23 21.71,28.76 U2.28
PB3: length 20.5
  Top Layer w0.152: v1(24.02,12.6) 23.87,12.45 v1(23.87,5.54)
  Bottom Layer w0.152: 23.86,4.06 23.86,5.09 CN2.2 ; U2.55 v1(20.71,19.46) 22.97,19.46 23.51,20 23.9,20 24.19,19.71 24.19,15.28 23.9,14.99 23.9,13.65 24.03,13.52 24.03,12.61 v1(24.02,12.6)
PB5: length 13.8
  Top Layer w0.152: v1(9.94,22) 10.17,22.23 17.31,22.23 17.84,22.76 18.31,22.76 v1(18.69,22.38)
  Bottom Layer w0.152: U2.57 19.71,20.21 18.69,21.22 v1(18.69,22.38) ; v1(9.94,22) U8.27
PB10: length 4
  Bottom Layer w0.152: v1(24.8,29.3) 24.8,29.25 24.03,28.48 22.48,28.48 22.21,28.75 U2.29
PC3: length 1.8
  Top Layer w0.152: v1(15.9,25.23) 15.9,25.3
  Bottom Layer w0.152: U2.11 v1(15.9,25.23)
PC4: length 38.5
  Top Layer w0.152: v1(12.09,11.21) 10.99,12.3 10.99,15.83 8.5,18.32 7.39,18.32 6.75,18.95 6.75,25.43 11.57,30.25 14.23,30.25 15.49,28.99 19.07,28.99 19.69,28.37 19.69,27.57 19.19,27.07 v1(19.19,26.7)
  Bottom Layer w0.152: U2.24 19.71,27.43 19.19,26.91 v1(19.19,26.7)
  Bottom Layer w0.254: U9.8 11.87,11.21 v1(12.09,11.21)
PC5: length 43
  Top Layer w0.152: v1(19.96,26.95) 19.96,28.46 19.18,29.24 15.6,29.24 14.33,30.5 11.46,30.5 6.56,25.6 2.16,25.6 1.65,25.08 1.65,15.04 2.33,14.36 4.87,14.36 5.36,13.87 v1(5.36,11.97)
  Bottom Layer w0.152: v1(19.96,26.96) 19.96,28.6 20.21,28.84 U2.25
  Bottom Layer w0.254: U10.8 5.44,11.84 5.36,11.93 v1(5.36,11.97)
PC13: length 65.8
  Top Layer w0.152: 36.47,29.9 35.9,29.9 ; v1(31.77,6.89) 31.92,6.74 31.92,5.81 31.47,5.36 27.71,5.36 27.33,5.75 27.33,9.3 26.98,9.65 v1(26.4,9.65)
  Bottom Layer w0.152: v1(26.4,9.65) 14.66,9.65 11.83,12.48 11.83,19.33 v1(12.72,20.22) 12.72,20.29 13.16,20.73 U2.2 ; v1(36.47,29.9) 36.56,29.9 37.87,28.59 37.87,16.54 36.95,15.63 36.95,12.32 36.47,11.84 35.2,11.84 34.44,11.08 34.44,10.57 34.04,10.17 31.73,10.17 31.17,9.61 31.17,8.43 31.92,7.67 31.92,7.04 v1(31.77,6.89)
$1N697: length 4.3
  Bottom Layer w0.254: U2.30 22.71,30.84 23.44,31.57 25.11,31.57 C7.1
$1N700: length 4.5
  Bottom Layer w0.254: U2.13 12.87,26.23 12.15,26.95 12.15,28.56 FB1.2
$1N3019: length 11.1
  Top Layer w0.152: LED1.2 34.28,31.15 v1(33.55,31.15)
  Bottom Layer w0.152: v1(33.55,31.15) 31.77,31.15 29.22,28.6 29.22,24.07 R1.2
$1N3273: length 10.9
  Top Layer w0.152: v1(15.97,11.97) 15.97,11.97 SW3.1 15.54,10.7 10.41,10.7 SW3.2
  Bottom Layer w0.152: R21.1 19.16,12.21 18.92,11.97 v1(15.97,11.97)
$1N3301: length 14
  Top Layer w0.152: SW4.2 20.64,11.14 20.64,11.94 20.86,11.94 24.82,15.9 v1(24.82,16.32)
  Bottom Layer w0.152: 20.64,11.94 26.08,11.94 26.64,11.39 v1(26.64,11.13) ; v1(24.82,16.32) R22.1
  vias: v1(20.64,11.95)
$1N3684: length 1.2
  Bottom Layer w0.508: C15.2 22.82,12.65
$1N4533: length 4.1
  Bottom Layer w0.508: R24.2 32.59,11.83 C23.1 32.42,11.77 31.37,11.77 31.34,11.8 U5.3
$1N4677: length 2.6
  Bottom Layer w0.508: U5.1 30.82,15.86 C24.1 ; C25.1 30.82,16.72
$1N5088: length 8.3
  Bottom Layer w0.508: L1.1 27.75,14.77 28.3,15.33 U5.6 28.74,15.64 C25.2 28.74,17.7 29.28,18.24 D3.1 30.33,18.24 31.14,17.43 31.61,17.43 31.91,17.13 C24.2
$1N5153: length 1.7
  Bottom Layer w0.508: R25.2 28.75,13.13 U5.4
$1N5247: length 7.7
  Bottom Layer w0.508: U5.5 29.87,14.38 30.15,14.1 C28.1 29.99,11.94 29.01,10.96 28.21,10.96 27.26,11.91 D4.1
$1N8073: length 2.4
  Bottom Layer w0.254: C29.1 11.3,14.67 10.59,15.38 U8.1
$1N8076: length 3.7
  Bottom Layer w0.254: C29.2 10.69,13.83 10.69,14.64 9.94,15.39 U8.2
$1N8080: length 2.1
  Bottom Layer w0.254: U8.3 9.29,15.5 9.8,14.98 C30.1
$1N8447: length 8.8
  Bottom Layer w0.152: U1.A5 35.81,18.43 37,19.62 37,22.1 36.51,22.6 R2.2
$1N8457: length 13.4
  Bottom Layer w0.152: U1.B5 36.37,15.43 37.61,16.67 37.61,21.85 36.61,22.86 34.74,22.86 R13.2
$1N8606: length 26.8
  Top Layer w0.152: v1(4.34,13.87) 2.46,13.87 1.16,15.17 v1(1.16,15.4)
  Bottom Layer w0.152: v1(1.16,15.4) 1.16,27.08 1.55,27.46 5.74,27.46 7.94,29.66 Q1.3 ; v1(6.97,14.73) 6.11,13.87 v1(4.34,13.87)
$1N14579: length 11.5
  Top Layer w0.152: v1(33.55,29.88) 34.28,29.88 LED2.2
  Bottom Layer w0.152: v1(33.55,29.88) 30.86,29.88 29.48,28.49 29.48,23.16 R38.2
$1N17688: length 11.1
  Top Layer w0.152: v1(19.58,21.05) 19.52,21.11 16.47,21.11 14.5,19.15 14.5,17.94 13.79,17.23 v1(13.75,17.23)
  Bottom Layer w0.152: v1(19.58,21.05) 20.27,21.05 21.1,20.22 v1(21.66,20.22) ; v1(13.75,17.23) 13.75,17.68 C39.2
$1N17689: length 12
  Top Layer w0.152: v1(19.79,21.7) 19.55,21.7 19.22,21.37 16.36,21.37 14.25,19.25 14.25,18.19 13.86,17.81 13.23,17.81 v1(12.65,17.23)
  Bottom Layer w0.152: v1(12.65,17.23) 12.65,17.23 C39.1 ; v1(19.79,21.7) 20.53,21.7 v1(21.38,20.85)
$1N17690: length 14.2
  Top Layer w0.152: v1(13.74,18.38) 13.74,19.11 16.26,21.62 19.03,21.62 19.83,22.42 19.83,22.81 19.45,23.19 v1(19,23.19)
  Bottom Layer w0.152: v1(21.66,21.47) 21.87,21.68 21.87,22.28 21.58,22.57 20.08,22.57 19.45,23.19 v1(19,23.19) ; 13.74,18.38 C33.2
$1N17691: length 11.3
  Top Layer w0.152: v1(12.65,18.38) 16.15,21.88 18.87,21.88 19.35,22.36 v1(19.35,22.61)
  Bottom Layer w0.152: v1(21.38,22.08) 21.23,22.24 19.72,22.24 v1(19.35,22.61) ; v1(12.65,18.38) C33.1
$1N17703: length 10
  Top Layer w0.152: U13.12 20.75,27.05 20.21,27.59 20.21,28.56 19.28,29.5 17.22,29.5 15.3,31.41 v1(15.08,31.41)
  Bottom Layer w0.152: v1(15.08,31.41) 15.59,31.41
$1N17705: length 8.1
  Top Layer w0.152: v1(17.31,31.41) 17.31,30.5 18.06,29.75 19.39,29.75 20.47,28.67 20.47,27.97 20.77,27.67 U13.13
  Bottom Layer w0.152: v1(17.31,31.41) C37.2
$1N17707: length 3.5
  Top Layer w0.152: U13.14 21.96,28.29 v1(21.96,31.08)
  Bottom Layer w0.152: C38.2 21.65,31.39 v1(21.96,31.08)
$1N17709: length 21.4
  Top Layer w0.152: v1(15.64,26.95) 15.64,26.68 16.13,26.2 19.7,26.2 20.72,25.18 v1(21.23,25.18) 21.25,25.19 U13.9 ; v1(12.71,27.97) v1(11.45,27.97)
  Bottom Layer w0.152: v1(12.71,27.97) 12.86,28.12 15.2,28.12 15.64,27.68 v1(15.64,26.95) ; v1(11.45,27.97) 10.43,27.97 10.17,28.22 8.76,28.22 C36.2 8.25,28.86 R16.2 8.37,29.08 8.91,29.62 10.18,29.62 10.77,30.21 D6.2
$1N26218: length 35.7
  Top Layer w0.152: v1(32.41,6.38) 32.41,7.8 34.08,9.47 34.08,11.23 34.76,11.91 36.67,11.91 36.98,12.22 36.98,14.48 36.27,15.19 36.27,18.86 37.11,19.7 37.11,22.54 36.8,22.85 34.08,22.85 31.97,20.73 31.06,20.73 30.5,21.29 30.5,21.94 v1(29.95,22.49)
  Bottom Layer w0.152: v1(32.41,6.38) 31.79,6.38 29.61,4.2 29.61,3.56 27.98,1.94 v1(27.96,1.94)
$1N26219: length 7.4
  Top Layer w0.35: 25.42,6.65 25.42,4.78 arc(25.45,4.62) 25.55,4.48 arc(25.69,4.38) 25.86,4.35 30.55,4.35 C42.2
$1N26220: length 2.9
  Top Layer w0.35: C42.1 30.67,3.09 arc(31.16,1.91) U14.1
$1N26221: length 6.3
  Top Layer w0.152: X2.3 23.01,2.7 26.31,2.7 26.56,2.45 26.56,1.45
$1N26222: length 2.7
  Top Layer w0.152: X2.1 24.19,2.32 25.04,2.32 25.29,2.06 25.29,1.45
$1N26227: length 15
  Top Layer w0.152: v1(31.63,21.49) 32.01,21.49 33.87,23.36 37.27,23.36 37.87,23.95 37.87,26.32 37.11,27.08 35.2,27.08 34.3,27.98 LED3.2
  Bottom Layer w0.152: v1(31.63,21.49) R46.2
$1N26246: length 37
  Top Layer w0.152: v1(33.17,6.38) 32.66,6.89 32.66,7.69 34.33,9.37 34.33,11.12 34.87,11.66 36.77,11.66 37.23,12.12 37.23,14.59 36.52,15.3 36.52,18.76 37.36,19.6 37.36,22.64 36.9,23.1 33.98,23.1 31.86,20.99 31.17,20.99 30.76,21.4 30.76,22.37 29.96,23.17 v1(29.96,23.4)
  Bottom Layer w0.152: v1(33.17,6.38) 32.69,5.9 31.67,5.9 29.87,4.09 29.87,3.46 29.23,2.82 v1(29.23,1.94)

## Copper pours and planes (outline as drawn; the poured copper is in the pictures)
GND on Top Layer: -3.53,33.71 43.46,33.71 43.46,-0.83 -3.53,-0.83
GND on Bottom Layer: -1.68,36.13 42.26,36.13 42.26,-2.35 -1.68,-2.35
VCC on Top Layer: 15.49,8.19 15.5,8.24 15.53,8.28 15.57,8.31 15.62,8.32 16.73,8.32 16.78,8.31 16.82,8.28 16.85,8.24 16.86,8.19 16.86,6.88 16.85,6.83 16.82,6.79 16.78,6.76 16.73,6.75 15.62,6.75 15.57,6.76 15.53,6.79 15.5,6.83 15.49,6.88

Small or netless copper shapes (teardrops, artwork), in the pictures only: 130 on Top Layer, 421 on Bottom Layer

## Text on the board
Bottom Silkscreen Layer: GND x4 | EasyFOC | C | B | A | V | G | DA | CL | Ver1.1 @kkl | CS CK SO SI | ADC | BLUETOOTH | SPI1 | I2C3 | SWD
Top Layer: Ctrl
Top Silkscreen Layer: Designed by @kkl | OLED128X64 | ▲ | EasyFOC | [Dev] | Ver1.1 @kkl | RST | G | RX | TX | USART6 | RT | BLUE / TOOTH | Fn | MOTOR0 | 12V ONLY
